# Altium schematic sheet BMS Slave.SchDoc
size A4; SheetNumber: 1; SheetTotal: 8
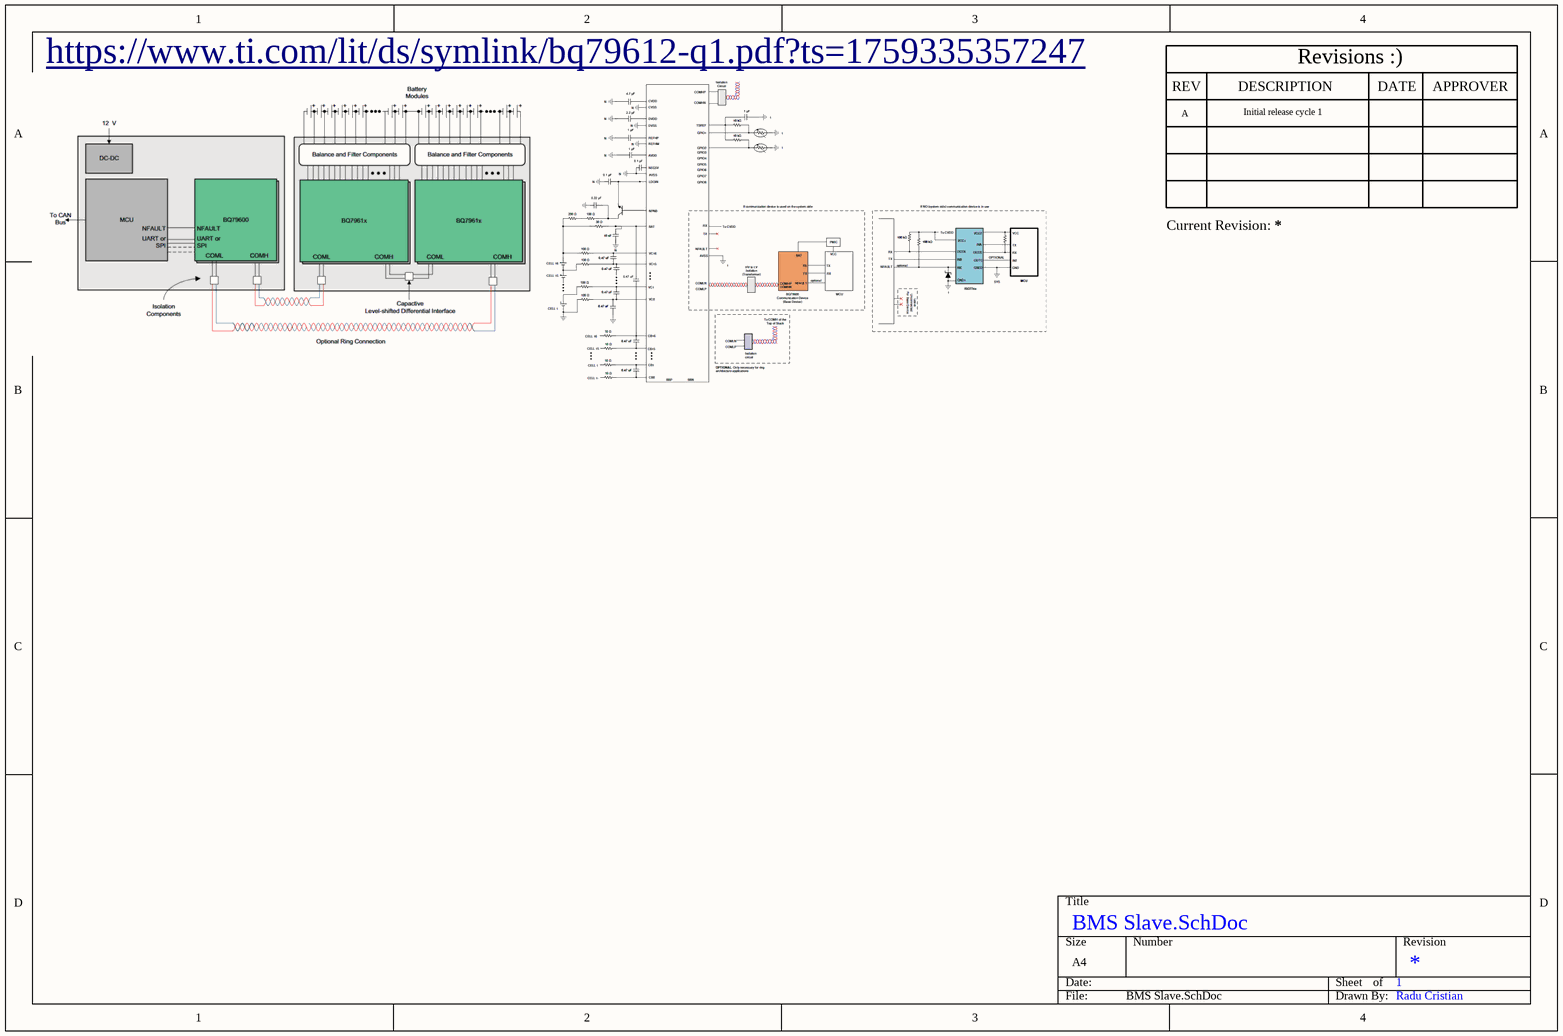
[diagram p0: BMS Slave.SchDoc]

## Notes on the sheet
- https://www.ti.com/lit/ds/symlink/bq79612-q1.pdf?ts=1759335357247
- REV
- A
- DESCRIPTION
- Initial release cycle 1
- Revisions :)
- DATE
- APPROVER
- Current Revision:
- Radu Cristian